# Altium project SM2200-PCB-1.PrjPCB
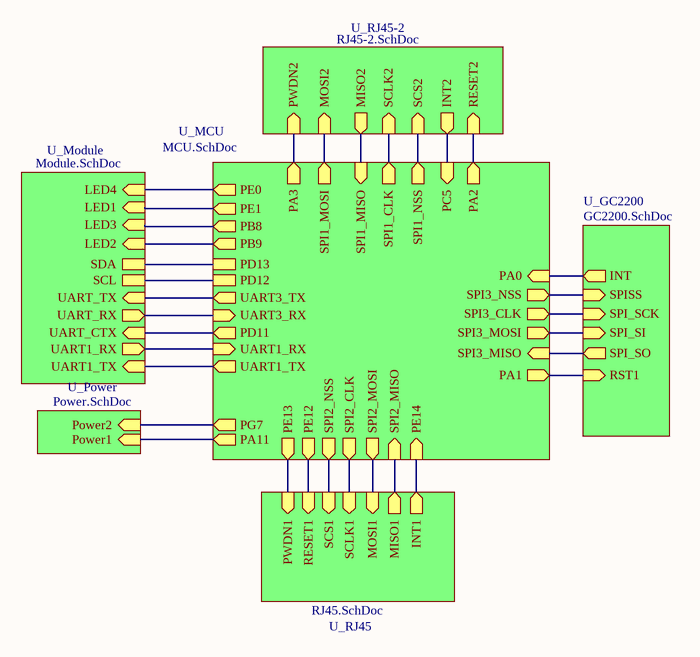
[diagram p0: Top.SchDoc]
7 sheets, 297 parts. Net scope: hierarchical (ports join the sheet entries above them; power ports are global).
Board file: Board.PcbDoc
Sheets:
  Top.SchDoc
    U_GC2200 = GC2200.SchDoc
    U_MCU = MCU.SchDoc
    U_Module = Module.SchDoc
    U_Power = Power.SchDoc
    U_RJ45-2 = RJ45-2.SchDoc
    U_RJ45 = RJ45.SchDoc

## Sheet Top.SchDoc
size A4

### Sub-sheets
U_GC2200 = GC2200.SchDoc: SPISS (in), SPI_SCK (in), SPI_SI (in), SPI_SO (out), RST1 (in), INT (out)
U_MCU = MCU.SchDoc: SPI1_NSS (out), SPI1_CLK (out), SPI1_MISO (in), SPI1_MOSI (out), SPI2_NSS (out), SPI2_CLK (out), SPI2_MISO (in), SPI2_MOSI (out), SPI3_CLK (out), SPI3_MOSI (out), SPI3_NSS (out), SPI3_MISO (in), PA3 (out), PC5 (in), PE13 (out), PE12 (out), PE14 (in), PA1 (out), PA2 (out), PA0 (in), UART1_TX (out), UART1_RX (in), UART3_TX (out), UART3_RX (in), PD11 (out), PD12, PD13, PG7 (out), PA11 (out), PE0 (out), PE1 (out), PB8 (out), PB9 (out)
U_Module = Module.SchDoc: UART_RX (out), UART_TX (in), UART_CTX (in), SCL, SDA, UART1_TX (in), UART1_RX (out), LED2 (in), LED3 (in), LED1 (in), LED4 (in)
U_Power = Power.SchDoc: Power1 (in), Power2 (in)
U_RJ45 = RJ45.SchDoc: INT1 (out), SCS1 (in), SCLK1 (in), MOSI1 (in), MISO1 (out), PWDN1 (in), RESET1 (in)
U_RJ45-2 = RJ45-2.SchDoc: INT2 (out), SCS2 (in), SCLK2 (in), MOSI2 (in), MISO2 (out), PWDN2 (in), RESET2 (in)

### Nets
INT: sheet U_GC2200/INT, sheet U_MCU/PA0
INT1: sheet U_MCU/PE14, sheet U_RJ45/INT1
INT2: sheet U_MCU/PC5, sheet U_RJ45-2/INT2
MISO1: sheet U_MCU/SPI2_MISO, sheet U_RJ45/MISO1
MISO2: sheet U_MCU/SPI1_MISO, sheet U_RJ45-2/MISO2
MOSI1: sheet U_MCU/SPI2_MOSI, sheet U_RJ45/MOSI1
MOSI2: sheet U_MCU/SPI1_MOSI, sheet U_RJ45-2/MOSI2
PWDN1: sheet U_MCU/PE13, sheet U_RJ45/PWDN1
PWDN2: sheet U_MCU/PA3, sheet U_RJ45-2/PWDN2
RESET1: sheet U_MCU/PE12, sheet U_RJ45/RESET1
RESET2: sheet U_MCU/PA2, sheet U_RJ45-2/RESET2
RST1: sheet U_GC2200/RST1, sheet U_MCU/PA1
SCLK1: sheet U_MCU/SPI2_CLK, sheet U_RJ45/SCLK1
SCLK2: sheet U_MCU/SPI1_CLK, sheet U_RJ45-2/SCLK2
SCS1: sheet U_MCU/SPI2_NSS, sheet U_RJ45/SCS1
SCS2: sheet U_MCU/SPI1_NSS, sheet U_RJ45-2/SCS2
SPI3_CLK: sheet U_GC2200/SPI_SCK, sheet U_MCU/SPI3_CLK
SPI3_MISO: sheet U_GC2200/SPI_SO, sheet U_MCU/SPI3_MISO
SPI3_MOSI: sheet U_GC2200/SPI_SI, sheet U_MCU/SPI3_MOSI
SPI3_NSS: sheet U_GC2200/SPISS, sheet U_MCU/SPI3_NSS
NetR41_1: sheet U_MCU/UART3_RX, sheet U_Module/UART_RX
NetR42_2: sheet U_MCU/PD12, sheet U_Module/SCL
NetR45_2: sheet U_MCU/PD13, sheet U_Module/SDA
NetR46_2: sheet U_MCU/PD11, sheet U_Module/UART_CTX
NetR49_1: sheet U_MCU/UART3_TX, sheet U_Module/UART_TX
NetR54_2: sheet U_MCU/PB8, sheet U_Module/LED3
NetR55_2: sheet U_MCU/PB9, sheet U_Module/LED2
NetR56_2: sheet U_MCU/PE0, sheet U_Module/LED4
NetR57_2: sheet U_MCU/PE1, sheet U_Module/LED1
NetR58_1: sheet U_MCU/UART1_TX, sheet U_Module/UART1_TX
NetR59_1: sheet U_MCU/UART1_RX, sheet U_Module/UART1_RX
NetR67_2: sheet U_MCU/PA11, sheet U_Power/Power1
NetR69_2: sheet U_MCU/PG7, sheet U_Power/Power2

## Sheet GC2200.SchDoc
size A4
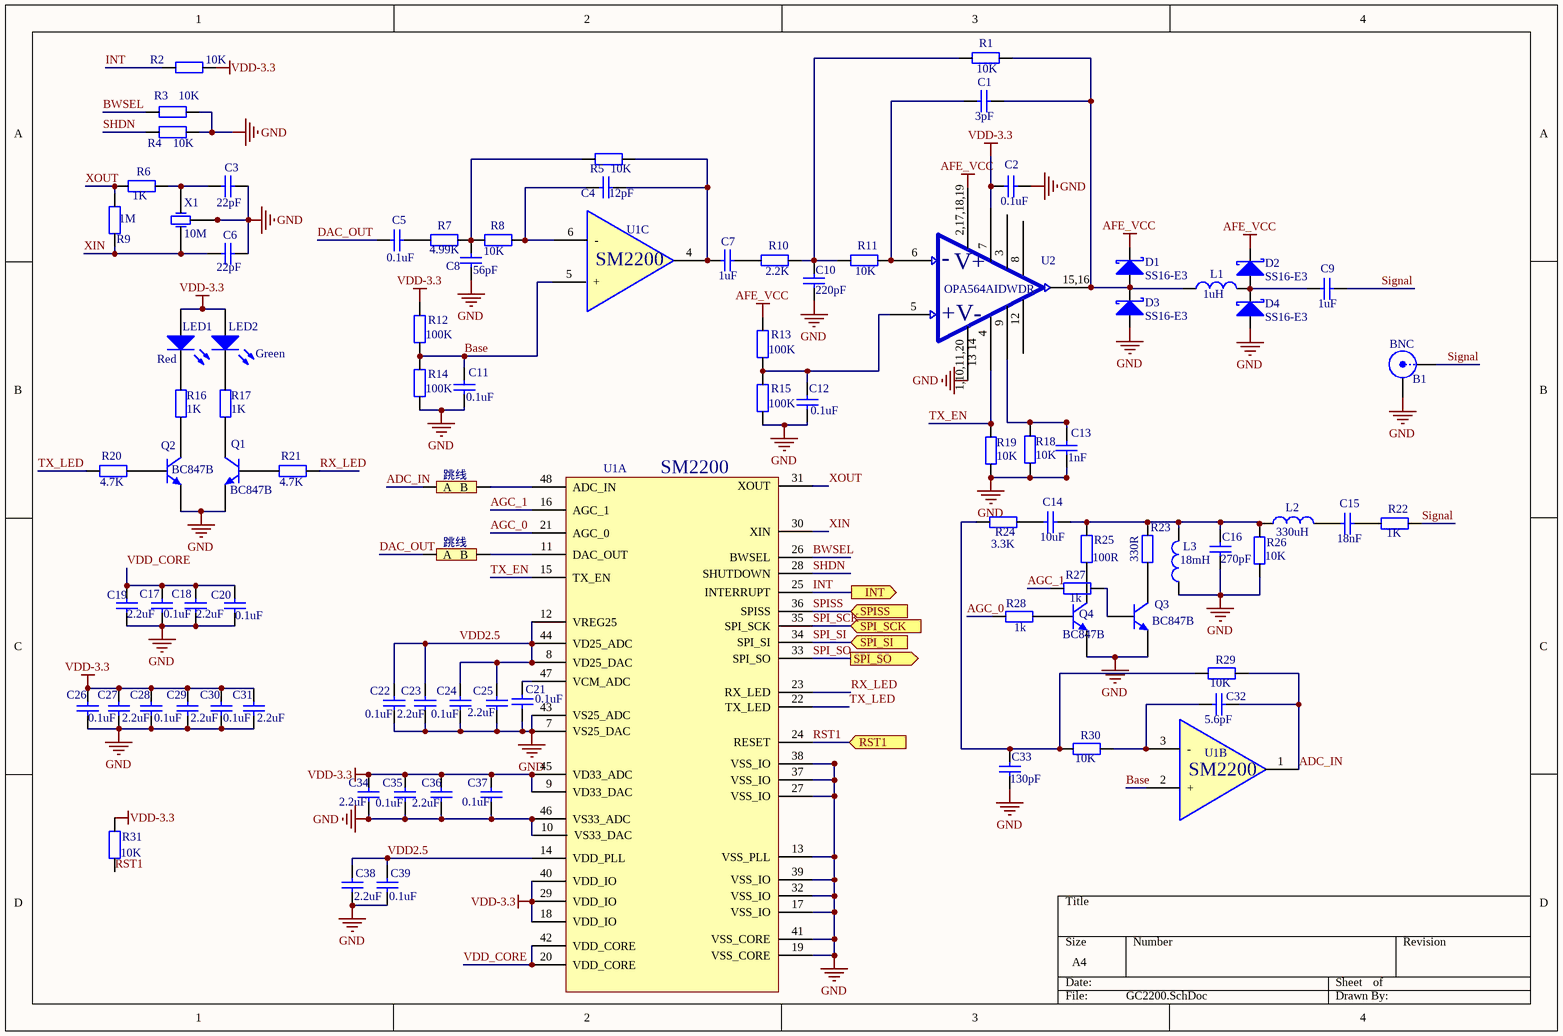
[diagram p1: GC2200.SchDoc]

### Parts
B1  BNC  [BNC]
C1  value 3pF  [0603]  (hidden comment: Capacitor-0603)
C2  value 0.1uF  [0603]  (hidden comment: Capacitor-0603)
C3  value 22pF  [0603]  (hidden comment: Capacitor-0805)
C4  value 12pF  [0603]  (hidden comment: Capacitor-0603)
C5  value 0.1uF  [0603]  (hidden comment: Capacitor-0603)
C6  value 22pF  [0603]  (hidden comment: Capacitor-0805)
C7  value 1uF  [0603]  (hidden comment: Capacitor-0603)
C8  value 56pF  [0603]  (hidden comment: Capacitor-0603)
C9  value 1uF  [0603]  (hidden comment: Capacitor-0603)
C10  value 220pF  [0603]  (hidden comment: Capacitor-0603)
C11  value 0.1uF  [0603]  (hidden comment: Capacitor-0603)
C12  value 0.1uF  [0603]  (hidden comment: Capacitor-0603)
C13  value 1nF  [0603]  (hidden comment: Capacitor-0603)
C14  value 10uF  [0805]  (hidden comment: Capacitor-0603)
C15  value 18nF  [0603]  (hidden comment: Capacitor-0603)
C16  value 270pF  [0603]  (hidden comment: Capacitor-0603)
C17  value 0.1uF  [0603]  (hidden comment: Capacitor-0805)
C18  value 2.2uF  [0603]  (hidden comment: Capacitor-0805)
C19  value 2.2uF  [0603]  (hidden comment: Capacitor-0805)
C20  value 0.1uF  [0603]  (hidden comment: Capacitor-0805)
C21  value 0.1uF  [0603]  (hidden comment: Capacitor-0805)
C22  value 0.1uF  [0603]  (hidden comment: Capacitor-0805)
C23  value 2.2uF  [0603]  (hidden comment: Capacitor-0805)
C24  value 0.1uF  [0603]  (hidden comment: Capacitor-0805)
C25  value 2.2uF  [0603]  (hidden comment: Capacitor-0805)
C26  value 0.1uF  [0603]  (hidden comment: Capacitor-0805)
C27  value 2.2uF  [0603]  (hidden comment: Capacitor-0805)
C28  value 0.1uF  [0603]  (hidden comment: Capacitor-0805)
C29  value 2.2uF  [0603]  (hidden comment: Capacitor-0805)
C30  value 0.1uF  [0603]  (hidden comment: Capacitor-0805)
C31  value 2.2uF  [0603]  (hidden comment: Capacitor-0805)
C32  value 5.6pF  [0603]  (hidden comment: Capacitor-0603)
C33  value 130pF  [0603]  (hidden comment: Capacitor-0603)
C34  value 2.2uF  [0603]  (hidden comment: Capacitor-0805)
C35  value 0.1uF  [0603]  (hidden comment: Capacitor-0805)
C36  value 2.2uF  [0603]  (hidden comment: Capacitor-0805)
C37  value 0.1uF  [0603]  (hidden comment: Capacitor-0805)
C38  value 2.2uF  [0603]  (hidden comment: Capacitor-0805)
C39  value 0.1uF  [0603]  (hidden comment: Capacitor-0805)
D1  Name: SS16-E3  [IN5824]  (hidden comment: SSA34)
D2  Name: SS16-E3  [IN5824]  (hidden comment: SSA34)
D3  Name: SS16-E3  [IN5824]  (hidden comment: SSA34)
D4  Name: SS16-E3  [IN5824]  (hidden comment: SSA34)
L1  value 1uH  [1206]  (hidden comment: Inductor)
L2  value 330uH  [Inductor  12*12]  (hidden comment: Inductor)
L3  value 18mH  [工字电感0608]  (hidden comment: Inductor)
LED1  Color: Red  [外插小灯]  (hidden comment: LED)
LED2  Color: Green  [外插小灯]  (hidden comment: LED)
Q1  BC847  [BC847B]  (value not drawn)
Q2  BC847  [BC847B]  (value not drawn)
Q3  BC847  [BC847B]  (value not drawn)
Q4  BC847  [BC847B]  (value not drawn)
R1  value 10K  [0603]  (hidden comment: Resistor-0603)
R2  value 10K  [0603]  (hidden comment: Resistor-0805)
R3  value 10K  [0603]  (hidden comment: Resistor-0805)
R4  value 10K  [0603]  (hidden comment: Resistor-0805)
R5  value 10K  [0603]  (hidden comment: Resistor-0603)
R6  value 1K  [0603]  (hidden comment: Resistor-0805)
R7  value 4.99K  [0603]  (hidden comment: Resistor-0603)
R8  value 10K  [0603]  (hidden comment: Resistor-0603)
R9  value 1M  [0603]  (hidden comment: Resistor-0805)
R10  value 2.2K  [0603]  (hidden comment: Resistor-0603)
R11  value 10K  [0603]  (hidden comment: Resistor-0603)
R12  value 100K  [0603]  (hidden comment: Resistor-0603)
R13  value 100K  [0603]  (hidden comment: Resistor-0603)
R14  value 100K  [0603]  (hidden comment: Resistor-0603)
R15  value 100K  [0603]  (hidden comment: Resistor-0603)
R16  value 1K  [0603]  (hidden comment: Resistor-0805)
R17  value 1K  [0603]  (hidden comment: Resistor-0805)
R18  value 10K  [0603]  (hidden comment: Resistor-0603)
R19  value 10K  [0603]  (hidden comment: Resistor-0603)
R20  value 4.7K  [0603]  (hidden comment: Resistor-0805)
R21  value 4.7K  [0603]  (hidden comment: Resistor-0805)
R22  value 1K  [0603]  (hidden comment: Resistor-0603)
R23  value 330R  [0603]  (hidden comment: Resistor-0603)
R24  value 3.3K  [0603]  (hidden comment: Resistor-0603)
R25  value 100R  [0603]  (hidden comment: Resistor-0603)
R26  value 10K  [0603]  (hidden comment: Resistor-0603)
R27  value 1k  [0603]  (hidden comment: Resistor-0603)
R28  value 1k  [0603]  (hidden comment: Resistor-0603)
R29  value 10K  [0603]  (hidden comment: Resistor-0603)
R30  value 10K  [0603]  (hidden comment: Resistor-0603)
R31  value 10K  [0603]  (hidden comment: Resistor-0805)
T1  跳线  [跳线 100mil]
T2  跳线  [跳线 100mil]
U1  SM2200  [SM2200]  (parts A,B,C of 3)
U2  OPA564AIDWDR  [OPA564AIDWDR]
X1  value 10M  [3225无源晶振]  (hidden comment: 3225无源晶振)

### Ports
INT (out), RST1 (in), SPI_SCK (in), SPI_SI (in), SPI_SO (out), SPISS (in)

### Nets
AFE_VCC: D1.2(K) D2.2(K) R13.2 U2.2,17,18,19
GND: B1.1(Y) C2.1 C3.2 C6.2 C8.1 C10.2 C11.1 C12.2 C13.1 C16.2 C17.1 C18.1 C19.1 C20.1 C21.1 C22.1 C23.1 C24.1 C25.1 C26.1 C27.1 C28.1 C29.1 C30.1 C31.1 C33.2 C34.1 C35.1 C36.1 C37.1 C38.1 C39.1 D3.1(A) D4.1(A) L3.1 Q1.1(E) Q2.1(E) Q3.1(E) Q4.1(E) R3.2 R4.2 R14.1 R15.1 R18.1 R19.1 R26.1 U1.7(VS25_DAC) U1.10(VS33_DAC) U1.13(VSS_PLL) U1.17(VSS_IO) U1.19(VSS_CORE) U1.27(VSS_IO) U1.32(VSS_IO) U1.37(VSS_IO) U1.38(VSS_IO) U1.39(VSS_IO) U1.41(VSS_CORE) U1.43(VS25_ADC) U1.46(VS33_ADC) U2.1,10,11,20 X1.2(GND) X1.4(GND)
VDD-3.3: C2.2 C26.2 C27.2 C28.2 C29.2 C30.2 C31.2 C34.2 C35.2 C36.2 C37.2 LED1.1(A) LED2.1(A) R2.2 R12.2 R31.1 U1.9(VD33_DAC) U1.18(VDD_IO) U1.29(VDD_IO) U1.40(VDD_IO) U1.45(VD33_ADC) U2.7
ADC_IN: C32.2 R29.1 T1.1(A) U1.1
AGC_0: R28.2 U1.21(AGC_0)
AGC_1: R27.2 U1.16(AGC_1)
Base: C11.2 R12.1 R14.2 U1.2(+) U1.5(+)
BWSEL: R3.1 U1.26(BWSEL)
DAC_OUT: C5.2 T2.1(A)
INT: R2.1 U1.25(INTERRUPT) ; port INT
RST1: R31.2 U1.24(RESET) ; port RST1
RX_LED: R21.1 U1.23(RX_LED)
SHDN: R4.1 U1.28(SHUTDOWN)
Signal: B1.2(X) C9.1 R22.2
SPI_SCK: U1.35(SPI_SCK) ; port SPI_SCK  [project net SPI3_CLK]
SPI_SI: U1.34(SPI_SI) ; port SPI_SI  [project net SPI3_MOSI]
SPI_SO: U1.33(SPI_SO) ; port SPI_SO  [project net SPI3_MISO]
SPISS: U1.36(SPISS) ; port SPISS  [project net SPI3_NSS]
TX_EN: R19.2 U1.15(TX_EN) U2.4
TX_LED: R20.2 U1.22(TX_LED)
VDD2.5: C22.2 C23.2 C24.2 C25.2 C38.2 C39.2 U1.8(VD25_DAC) U1.12(VREG25) U1.14(VDD_PLL) U1.44(VD25_ADC)
VDD_CORE: C17.2 C18.2 C19.2 C20.2 U1.20(VDD_CORE) U1.42(VDD_CORE)
XIN: C6.1 R9.1 U1.30(XIN) X1.1(OSC1)
XOUT: R6.1 R9.2 U1.31(XOUT)
NetC1_1: C1.1 D1.1(A) D3.2(K) L1.1 R1.2 U2.15,16
NetC1_2: C1.2 R11.2 U2.6
NetC3_1: C3.1 R6.2 X1.3(OSC2)
NetC4_1: C4.1 C7.2 R5.2 U1.4
NetC4_2: C4.2 R8.2 U1.6(-)
NetC5_1: C5.1 R7.1
NetC7_1: C7.1 R10.1
NetC8_2: C8.2 R5.1 R7.2 R8.1
NetC9_2: C9.2 D2.1(A) D4.2(K) L1.2
NetC10_1: C10.1 R1.1 R10.2 R11.1
NetC12_1: C12.1 R13.1 R15.2 U2.5
NetC13_2: C13.2 R18.2 U2.9
NetC14_1: C14.1 C16.1 L2.1 L3.2 R23.2 R25.2 R26.2
NetC14_2: C14.2 R24.1
NetC15_1: C15.1 R22.1
NetC15_2: C15.2 L2.2
NetC21_2: C21.2 U1.47(VCM_ADC)
NetC32_1: C32.1 R30.1 U1.3(-)
NetC33_1: C33.1 R24.2 R29.2 R30.2
NetLED1_2: LED1.2 R16.2
NetLED2_2: LED2.2 R17.2
NetQ1_2: Q1.2(B) R21.2
NetQ1_3: Q1.3(C) R17.1
NetQ2_2: Q2.2(B) R20.1
NetQ2_3: Q2.3(C) R16.1
NetQ3_2: Q3.2(B) R27.1
NetQ3_3: Q3.3(C) R23.1
NetQ4_2: Q4.2(B) R28.1
NetQ4_3: Q4.3(C) R25.1
NetT1_2: T1.2(B) U1.48(ADC_IN)
NetT2_2: T2.2(B) U1.11(DAC_OUT)

Not connected (* = marked no-connect by the designer): U2 3 8 12

### Notes on the sheet
- (in symbol OPA564AIDWDR) -; V+; +; V-; 14; 13

### Library data of the parts
C3 C6 C17-C31 C34-C39 = Capacito
R2-R4 R6 R9 R16 R17 R20 R21 R31 = Resisto
U2 = OPA564AIDWDR: pin to pad: 1,10,11,20>1+10+11+20+13+14; Name: OPA564AIDWDR
B1 = BNC: Name: BNC
LED1 LED2 = LED: Value: LED
Q1-Q4 = BC847: Name: BC847B
T1 T2 = 跳线: Value: 跳线

## Sheet MCU.SchDoc
size A4
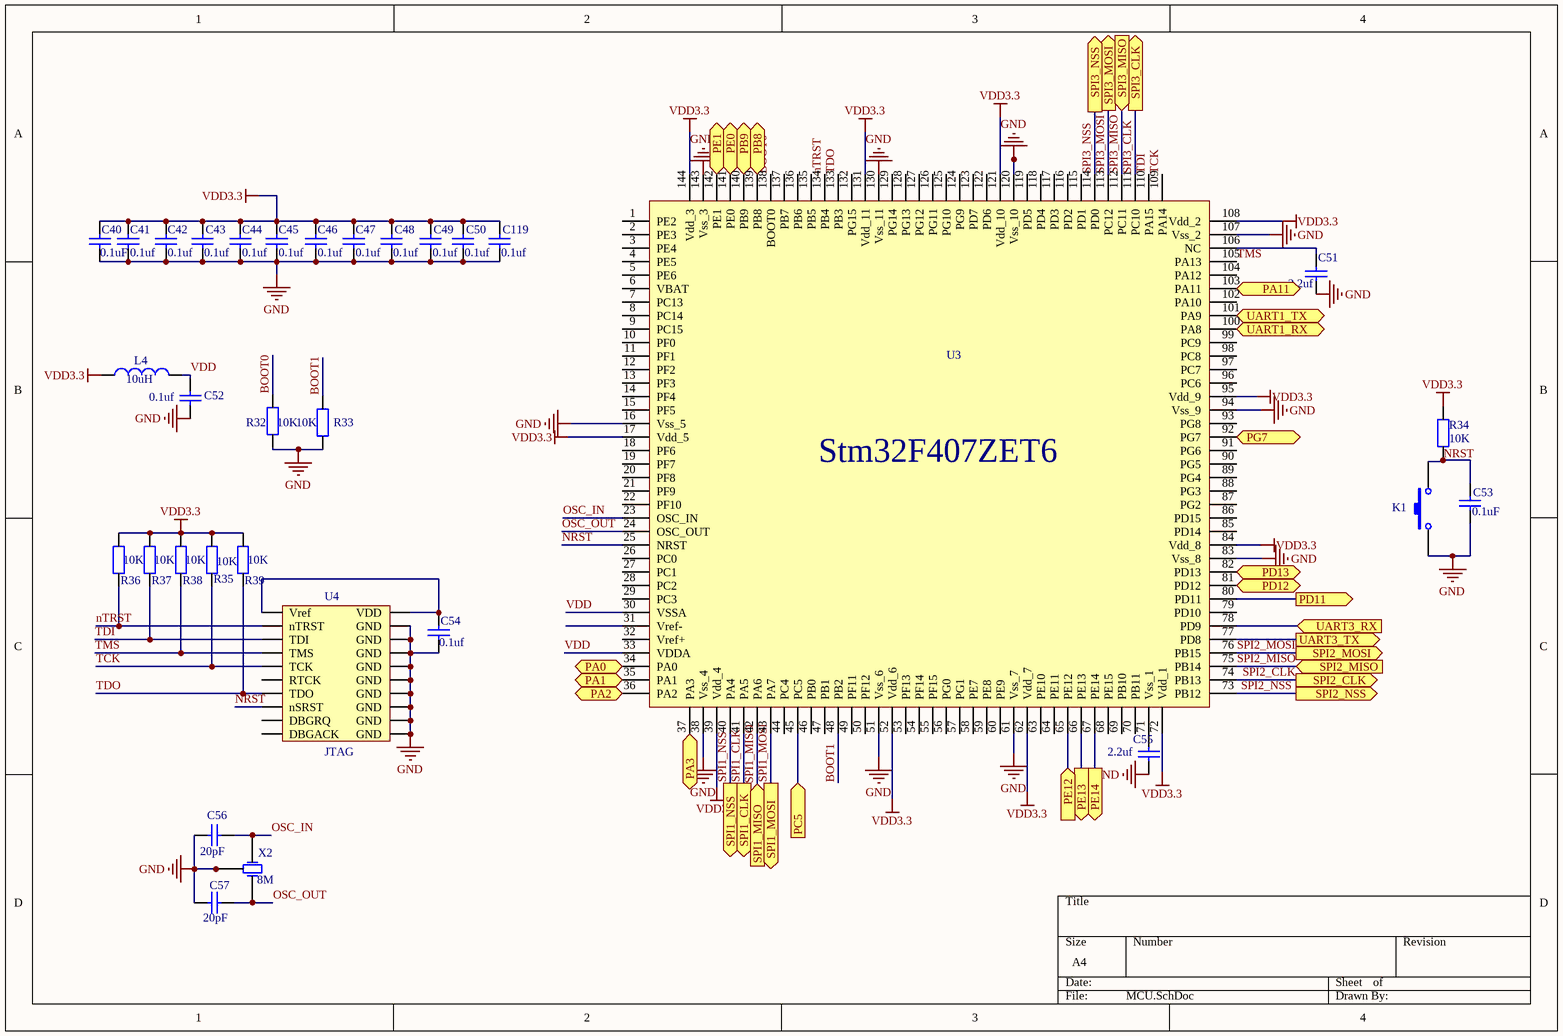
[diagram p2: MCU.SchDoc]

### Parts
C40  value 0.1uF  [0603]  (hidden comment: Capacitor-0805)
C41  value 0.1uf  [0603]  (hidden comment: Capacitor-0805)
C42  value 0.1uf  [0603]  (hidden comment: Capacitor-0805)
C43  value 0.1uf  [0603]  (hidden comment: Capacitor-0805)
C44  value 0.1uf  [0603]  (hidden comment: Capacitor-0805)
C45  value 0.1uf  [0603]  (hidden comment: Capacitor-0805)
C46  value 0.1uf  [0603]  (hidden comment: Capacitor-0805)
C47  value 0.1uf  [0603]  (hidden comment: Capacitor-0805)
C48  value 0.1uf  [0603]  (hidden comment: Capacitor-0805)
C49  value 0.1uf  [0603]  (hidden comment: Capacitor-0805)
C50  value 0.1uf  [0603]  (hidden comment: Capacitor-0805)
C51  value 2.2uf  [0603]  (hidden comment: Capacitor-0603)
C52  value 0.1uf  [0603]  (hidden comment: Capacitor-0805)
C53  value 0.1uF  [0603]  (hidden comment: Capacitor-0805)
C54  value 0.1uf  [0603]  (hidden comment: Capacitor-0805)
C55  value 2.2uf  [0603]  (hidden comment: Capacitor-0603)
C56  value 20pF  [0603]  (hidden comment: Capacitor-0805)
C57  value 20pF  [0603]  (hidden comment: Capacitor-0805)
C119  value 0.1uf  [0603]  (hidden comment: Capacitor-0805)
K1  按键  [贴片按键]  (value not drawn)
L4  value 10uH  [0805]  (hidden comment: Inductor)
R32  value 10K  [0603]  (hidden comment: Resistor-0805)
R33  value 10K  [0603]  (hidden comment: Resistor-0805)
R34  value 10K  [0603]  (hidden comment: Resistor-0805)
R35  value 10K  [0603]  (hidden comment: Resistor-0805)
R36  value 10K  [0603]  (hidden comment: Resistor-0805)
R37  value 10K  [0603]  (hidden comment: Resistor-0805)
R38  value 10K  [0603]  (hidden comment: Resistor-0805)
R39  value 10K  [0603]  (hidden comment: Resistor-0805)
U3  STM32F407ZET6  [Stm32f407ZET6 - duplicate]  (value not drawn)
U4  JTAG  [JTAG-20]
X2  value 8M  [3225无源晶振]  (hidden comment: 3225无源晶振)

### Ports
PA0 (in), PA1 (out), PA2 (out), PA3 (out), PA11 (out), PB8 (out), PB9 (out), PC5 (in), PD11 (out), PD12, PD13, PE0 (out), PE1 (out), PE12 (in), PE13 (out), PE14 (out), PG7 (out), SPI1_CLK (out), SPI1_MISO (in), SPI1_MOSI (out), SPI1_NSS (out), SPI2_CLK (out), SPI2_MISO (in), SPI2_MOSI (out), SPI2_NSS (out), SPI3_CLK (out), SPI3_MISO (in), SPI3_MOSI (out), SPI3_NSS (out), UART1_RX (in), UART1_TX (out), UART3_RX (in), UART3_TX (out)

### Nets
GND: C40.1 C41.1 C42.1 C43.1 C44.1 C45.1 C46.1 C47.1 C48.1 C49.1 C50.1 C51.1 C52.1 C53.1 C54.1 C55.1 C56.1 C57.1 C119.1 K1.1 R32.1 R33.1 U3.16(Vss_5) U3.38(Vss_4) U3.51(Vss_6) U3.61(Vss_7) U3.83(Vss_8) U3.94(Vss_9) U3.107(Vss_2) U3.120(Vss_10) U3.130(Vss_11) U3.143(Vss_3) U4.4(GND) U4.6(GND) U4.8(GND) U4.10(GND) U4.12(GND) U4.14(GND) U4.16(GND) U4.18(GND) U4.20(GND) X2.2(GND) X2.4(GND)
VDD3.3: C40.2 C41.2 C42.2 C43.2 C44.2 C45.2 C46.2 C47.2 C48.2 C49.2 C50.2 C119.2 L4.1 R34.2 R35.2 R36.2 R37.2 R38.2 R39.2 U3.17(Vdd_5) U3.39(Vdd_4) U3.52(Vdd_6) U3.62(Vdd_7) U3.72(Vdd_1) U3.84(Vdd_8) U3.95(Vdd_9) U3.108(Vdd_2) U3.121(Vdd_10) U3.131(Vdd_11) U3.144(Vdd_3)
BOOT0: R32.2 U3.138(BOOT0)
BOOT1: R33.2 U3.48(PB2)
INT: U3.34(PA0) ; port PA0
INT1: U3.67(PE14) ; port PE14
INT2: U3.45(PC5) ; port PC5
NRST: C53.2 K1.2 R34.1 U3.25(NRST) U4.15(nSRST)
nTRST: R36.1 U3.134(PB4) U4.3(nTRST)
OSC_IN: C56.2 U3.23(OSC_IN) X2.1(OSC1)
OSC_OUT: C57.2 U3.24(OSC_OUT) X2.3(OSC2)
PWDN1: U3.66(PE13) ; port PE13
PWDN2: U3.37(PA3) ; port PA3
RESET1: U3.65(PE12) ; port PE12
RESET2: U3.36(PA2) ; port PA2
RST1: U3.35(PA1) ; port PA1
SPI1_CLK: U3.41(PA5) ; port SPI1_CLK  [project net SCLK2]
SPI1_MISO: U3.42(PA6) ; port SPI1_MISO  [project net MISO2]
SPI1_MOSI: U3.43(PA7) ; port SPI1_MOSI  [project net MOSI2]
SPI1_NSS: U3.40(PA4) ; port SPI1_NSS  [project net SCS2]
SPI2_CLK: U3.74(PB13) ; port SPI2_CLK  [project net SCLK1]
SPI2_MISO: U3.75(PB14) ; port SPI2_MISO  [project net MISO1]
SPI2_MOSI: U3.76(PB15) ; port SPI2_MOSI  [project net MOSI1]
SPI2_NSS: U3.73(PB12) ; port SPI2_NSS  [project net SCS1]
SPI3_CLK: U3.111(PC10) ; port SPI3_CLK
SPI3_MISO: U3.112(PC11) ; port SPI3_MISO
SPI3_MOSI: U3.113(PC12) ; port SPI3_MOSI
SPI3_NSS: U3.114(PD0) ; port SPI3_NSS
TCK: R35.1 U3.109(PA14) U4.9(TCK)
TDI: R37.1 U3.110(PA15) U4.5(TDI)
TDO: R39.1 U3.133(PB3) U4.13(TDO)
TMS: R38.1 U3.105(PA13) U4.7(TMS)
VDD: C52.2 L4.2 U3.30(VSSA) U3.33(VDDA)
NetC51_2: C51.2 U3.106(NC)
NetC54_2: C54.2 U4.1(Vref) U4.2(VDD)
NetC55_2: C55.2 U3.71(Vss_1)
NetR41_1: U3.78(PD9) ; port UART3_RX
NetR42_2: U3.81(PD12) ; port PD12
NetR45_2: U3.82(PD13) ; port PD13
NetR46_2: U3.80(PD11) ; port PD11
NetR49_1: U3.77(PD8) ; port UART3_TX
NetR54_2: U3.139(PB8) ; port PB8
NetR55_2: U3.140(PB9) ; port PB9
NetR56_2: U3.141(PE0) ; port PE0
NetR57_2: U3.142(PE1) ; port PE1
NetR58_1: U3.101(PA9) ; port UART1_TX
NetR59_1: U3.100(PA8) ; port UART1_RX
NetR67_2: U3.103(PA11) ; port PA11
NetR69_2: U3.92(PG7) ; port PG7

Not connected (* = marked no-connect by the designer): U3 1(PE2) 2(PE3) 3(PE4) 4(PE5) 5(PE6) 6(VBAT) 7(PC13) 8(PC14) 9(PC15) 10(PF0) 11(PF1) 12(PF2) 13(PF3) 14(PF4) 15(PF5) 18(PF6) 19(PF7) 20(PF8) 21(PF9) 22(PF10) 26(PC0) 27(PC1) 28(PC2) 29(PC3) 31(Vref-) 32(Vref+) 44(PC4) 46(PB0) 47(PB1) 49(PF11) 50(PF12) 53(PF13) 54(PF14) 55(PF15) 56(PG0) 57(PG1) 58(PE7) 59(PE8) 60(PE9) 63(PE10) 64(PE11) 68(PE15) 69(PB10) 70(PB11) 79(PD10) 85(PD14) 86(PD15) 87(PG2) 88(PG3) 89(PG4) 90(PG5) 91(PG6) 93(PG8) 96(PC6) 97(PC7) 98(PC8) 99(PC9) 102(PA10) 104(PA12) 115(PD1) 116(PD2) 117(PD3) 118(PD4) 119(PD5) 122(PD6) 123(PD7) 124(PG9) 125(PG10) 126(PG11) 127(PG12) 128(PG13) 129(PG14) 132(PG15) 135(PB5) 136(PB6) 137(PB7); U4 11(RTCK) 17(DBGRQ) 19(DBGACK)

### Notes on the sheet
- (in symbol STM32F407Z) Stm32F407ZET6

### Library data of the parts
C40-C50 C52 C54 C119 = Capacitor
C53 C56 C57 = Capacitor-0
L4 = Ind
R32 R33 = Resistor
R34-R39 = Resistor-0
U3 = STM32F407Z: Value: STM32F407ZET6
U4 = J: Value: JTAG

## Sheet Module.SchDoc
size A4
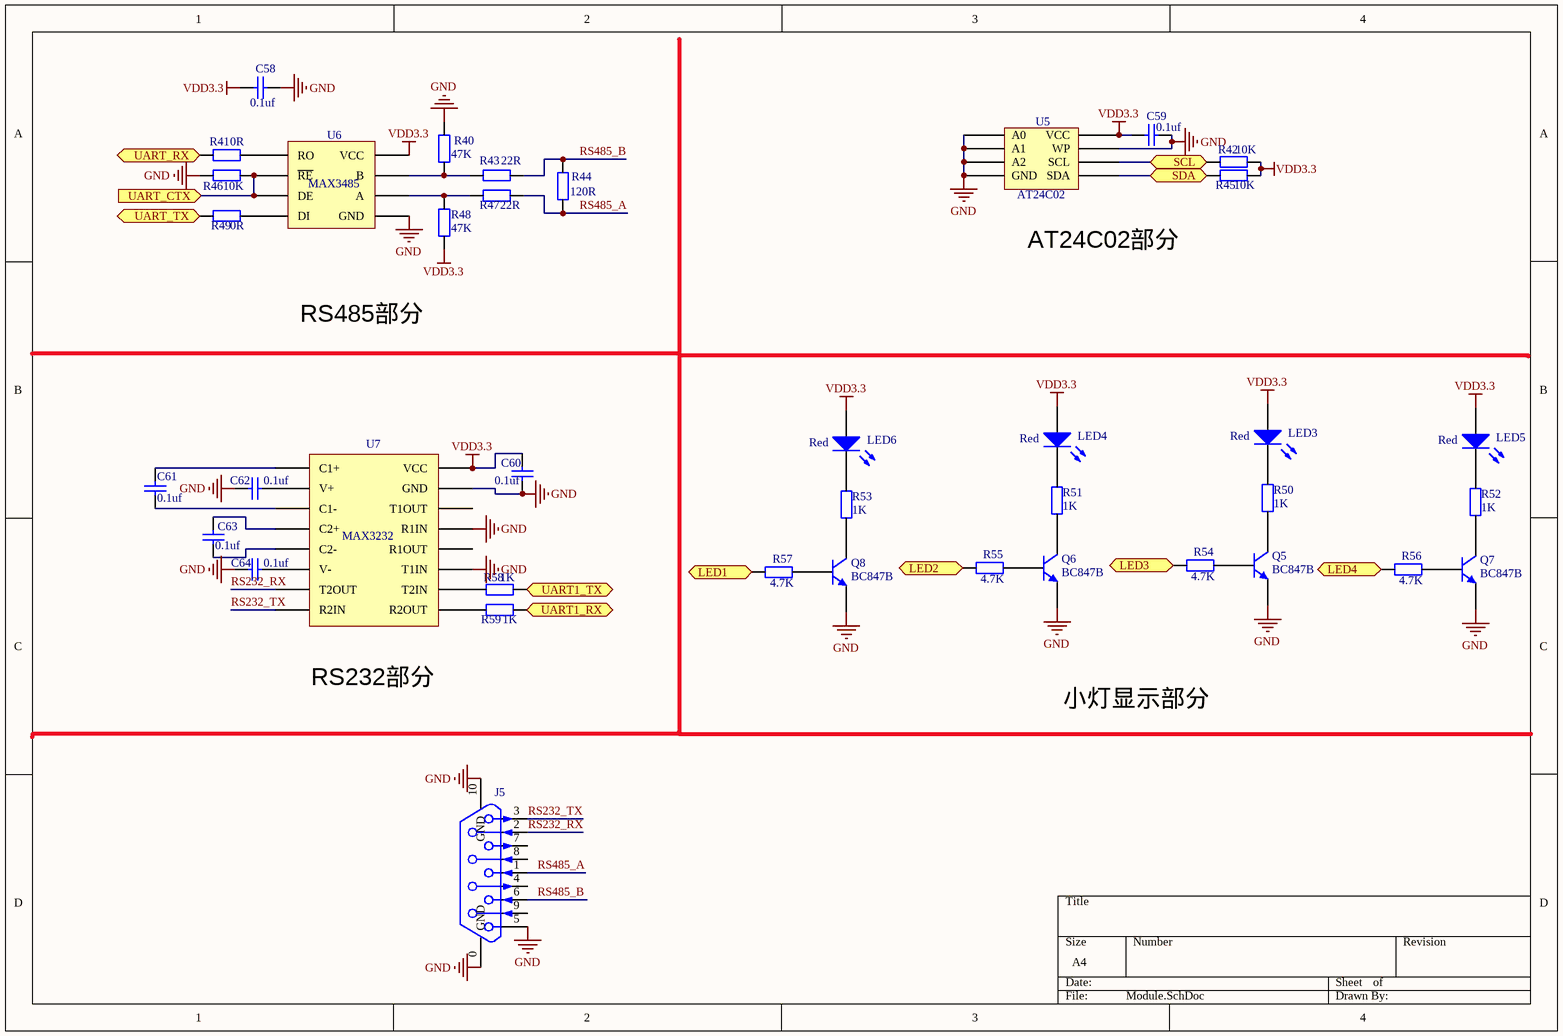
[diagram p3: Module.SchDoc]

### Parts
C58  value 0.1uf  [0603]  (hidden comment: Capacitor-0603)
C59  value 0.1uf  [0603]  (hidden comment: Capacitor-0603)
C60  value 0.1uf  [0603]  (hidden comment: Capacitor-0603)
C61  value 0.1uf  [0603]  (hidden comment: Capacitor-0603)
C62  value 0.1uf  [0603]  (hidden comment: Capacitor-0603)
C63  value 0.1uf  [0603]  (hidden comment: Capacitor-0603)
C64  value 0.1uf  [0603]  (hidden comment: Capacitor-0603)
J5  DB9  [DB9]  (value not drawn)
LED3  Color: Red  [外插小灯]  (hidden comment: LED)
LED4  Color: Red  [外插小灯]  (hidden comment: LED)
LED5  Color: Red  [外插小灯]  (hidden comment: LED)
LED6  Color: Red  [外插小灯]  (hidden comment: LED)
Q5  BC847  [BC847B]  (value not drawn)
Q6  BC847  [BC847B]  (value not drawn)
Q7  BC847  [BC847B]  (value not drawn)
Q8  BC847  [BC847B]  (value not drawn)
R40  value 47K  [0603]  (hidden comment: Resistor-0603)
R41  value 0R  [0603]  (hidden comment: Resistor-0603)
R42  value 10K  [0603]  (hidden comment: Resistor-0603)
R43  value 22R  [0603]  (hidden comment: Resistor-0603)
R44  value 120R  [0603]  (hidden comment: Resistor-0603)
R45  value 10K  [0603]  (hidden comment: Resistor-0603)
R46  value 10K  [0603]  (hidden comment: Resistor-0603)
R47  value 22R  [0603]  (hidden comment: Resistor-0603)
R48  value 47K  [0603]  (hidden comment: Resistor-0603)
R49  value 0R  [0603]  (hidden comment: Resistor-0603)
R50  value 1K  [0603]  (hidden comment: Resistor-0603)
R51  value 1K  [0603]  (hidden comment: Resistor-0603)
R52  value 1K  [0603]  (hidden comment: Resistor-0603)
R53  value 1K  [0603]  (hidden comment: Resistor-0603)
R54  value 4.7K  [0603]  (hidden comment: Resistor-0603)
R55  value 4.7K  [0603]  (hidden comment: Resistor-0603)
R56  value 4.7K  [0603]  (hidden comment: Resistor-0603)
R57  value 4.7K  [0603]  (hidden comment: Resistor-0603)
R58  value 1K  [0603]  (hidden comment: Resistor-0603)
R59  value 1K  [0603]  (hidden comment: Resistor-0603)
U5  AT24C02  [AT24C02]
U6  MAX3485  [MAX3485]
U7  MAX3232  [MAX3232]

### Ports
LED1 (in), LED2 (in), LED3 (in), LED4 (in), SCL, SDA, UART1_RX (out), UART1_TX (in), UART_CTX (in), UART_RX (out), UART_TX (in)

### Nets
GND: C58.2 C59.1 C60.1 C62.2 C64.2 J5.0(GND) J5.5 J5.10(GND) Q5.1(E) Q6.1(E) Q7.1(E) Q8.1(E) R40.2 R46.1 U5.1(A0) U5.2(A1) U5.3(A2) U5.4(GND) U5.7(WP) U6.5(GND) U7.11(T1IN) U7.13(R1IN) U7.15(GND)
VDD3.3: C58.1 C59.2 C60.2 LED3.1(A) LED4.1(A) LED5.1(A) LED6.1(A) R42.1 R45.1 R48.1 U5.8(VCC) U6.8(VCC) U7.16(VCC)
RS232_RX: J5.2 U7.7(T2OUT)
RS232_TX: J5.3 U7.8(R2IN)
RS485_A: J5.1 R44.2 R47.1
RS485_B: J5.6 R43.1 R44.1
NetC61_1: C61.1 U7.3(C1-)
NetC61_2: C61.2 U7.1(C1+)
NetC62_1: C62.1 U7.2(V+)
NetC63_1: C63.1 U7.5(C2-)
NetC63_2: C63.2 U7.4(C2+)
NetC64_1: C64.1 U7.6(V-)
NetLED3_2: LED3.2 R50.2
NetLED4_2: LED4.2 R51.2
NetLED5_2: LED5.2 R52.2
NetLED6_2: LED6.2 R53.2
NetQ5_2: Q5.2(B) R54.1
NetQ5_3: Q5.3(C) R50.1
NetQ6_2: Q6.2(B) R55.1
NetQ6_3: Q6.3(C) R51.1
NetQ7_2: Q7.2(B) R56.1
NetQ7_3: Q7.3(C) R52.1
NetQ8_2: Q8.2(B) R57.1
NetQ8_3: Q8.3(C) R53.1
NetR40_1: R40.1 R43.2 U6.7(B)
NetR41_1: R41.1 ; port UART_RX
NetR41_2: R41.2 U6.1(RO)
NetR42_2: R42.2 U5.6(SCL) ; port SCL
NetR45_2: R45.2 U5.5(SDA) ; port SDA
NetR46_2: R46.2 U6.2(~{RE}) U6.3(DE) ; port UART_CTX
NetR47_2: R47.2 R48.2 U6.6(A)
NetR49_1: R49.1 ; port UART_TX
NetR49_2: R49.2 U6.4(DI)
NetR54_2: R54.2 ; port LED3
NetR55_2: R55.2 ; port LED2
NetR56_2: R56.2 ; port LED4
NetR57_2: R57.2 ; port LED1
NetR58_1: R58.1 ; port UART1_TX
NetR58_2: R58.2 U7.10(T2IN)
NetR59_1: R59.1 ; port UART1_RX
NetR59_2: R59.2 U7.9(R2OUT)

Not connected (* = marked no-connect by the designer): J5 4 7 8 9; U7 12(R1OUT) 14(T1OUT)

### Notes on the sheet
- (near U5) AT24C02部分
- RS485部分
- RS232部分
- 小灯显示部分

### Library data of the parts
LED3-LED6 = LED: Value: LED
Q5-Q8 = BC847: Name: BC847B
U5 = AT24C02: Name: AT24C02
U6 = MAX3485: Name: MAX3485
U7 = MAX3232: Name: MAX3232

## Sheet Power.SchDoc
size A4
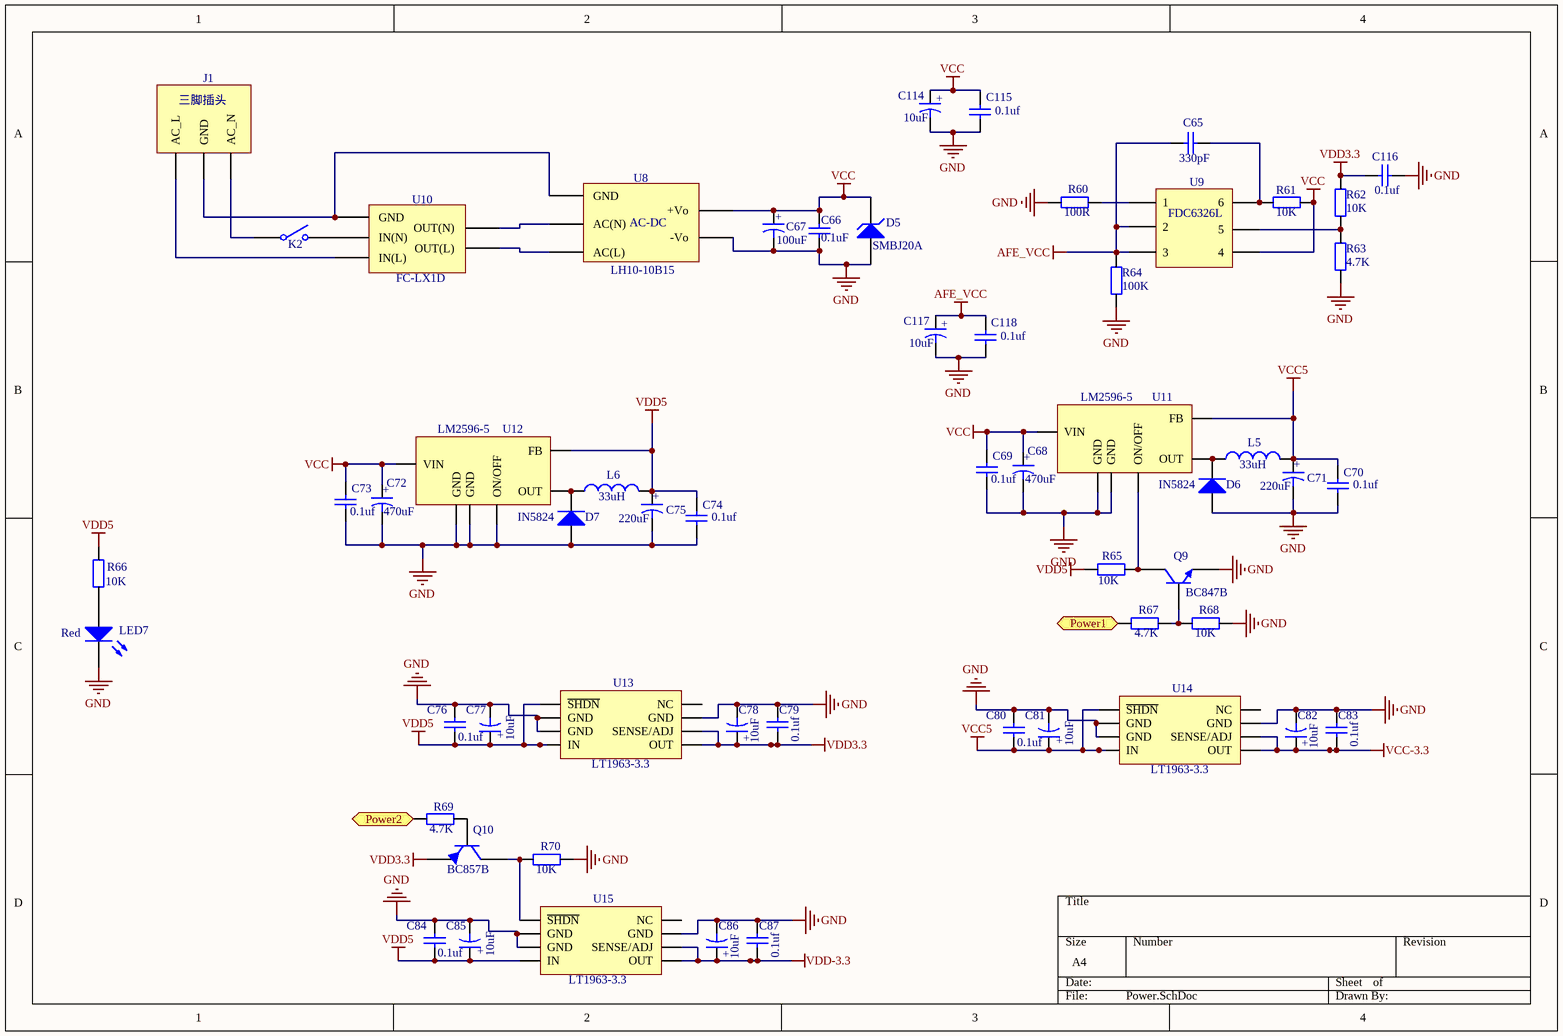
[diagram p4: Power.SchDoc]

### Parts
C65  value 330pF  [0805]  (hidden comment: Capacitor-0805)
C66  value 0.1uF  [0805]  (hidden comment: Capacitor-0805)
C67  value 100uF  [贴片铝电容-8*10.3]  (hidden comment: 电解电容)
C68  value 470uF  [贴片铝电容-10*10]  (hidden comment: 电解电容)
C69  value 0.1uf  [0805]  (hidden comment: Capacitor-0805)
C70  value 0.1uf  [0805]  (hidden comment: Capacitor-0805)
C71  value 220uF  [贴片铝电容-8*10.3]  (hidden comment: 电解电容)
C72  value 470uF  [贴片铝电容-10*10]  (hidden comment: 电解电容)
C73  value 0.1uf  [0805]  (hidden comment: Capacitor-0805)
C74  value 0.1uf  [0805]  (hidden comment: Capacitor-0805)
C75  value 220uF  [贴片铝电容-8*10.3]  (hidden comment: 电解电容)
C76  value 0.1uf  [0805]  (hidden comment: Capacitor-0805)
C77  value 10uF  [钽电容1206（A3216）]  (hidden comment: 电解电容)
C78  value 10uF  [钽电容1206（A3216）]  (hidden comment: 电解电容)
C79  value 0.1uf  [0805]  (hidden comment: Capacitor-0805)
C80  value 0.1uf  [0805]  (hidden comment: Capacitor-0805)
C81  value 10uF  [钽电容1206（A3216）]  (hidden comment: 电解电容)
C82  value 10uF  [钽电容1206（A3216）]  (hidden comment: 电解电容)
C83  value 0.1uf  [0805]  (hidden comment: Capacitor-0805)
C84  value 0.1uf  [0805]  (hidden comment: Capacitor-0805)
C85  value 10uF  [钽电容1206（A3216）]  (hidden comment: 电解电容)
C86  value 10uF  [钽电容1206（A3216）]  (hidden comment: 电解电容)
C87  value 0.1uf  [0805]  (hidden comment: Capacitor-0805)
C114  value 10uF  [3528]  (hidden comment: 电解电容)
C115  value 0.1uf  [0805]  (hidden comment: Capacitor-0805)
C116  value 0.1uf  [0603]  (hidden comment: Capacitor-0805)
C117  value 10uF  [3528]  (hidden comment: 电解电容)
C118  value 0.1uf  [0805]  (hidden comment: Capacitor-0805)
D5  SMBJ20A  [SMBJ20A]
D6  IN5824  [IN5824]
D7  IN5824  [IN5824]
J1  三脚插头  [三芯蛙座]
K2  开关  [T型接头]  (value not drawn)
L5  value 33uH  [SLF6025   电感]  (hidden comment: Inductor)
L6  value 33uH  [SLF6025   电感]  (hidden comment: Inductor)
LED7  Color: Red  [外插小灯]  (hidden comment: LED)
Q9  BC847  [BC847B]  (value not drawn)
Q10  Name: BC857B  [BC847B]  (hidden comment: BC587B)
R60  value 100R  [0603]  (hidden comment: Resistor-0603)
R61  value 10K  [0603]  (hidden comment: Resistor-0603)
R62  value 10K  [0603]  (hidden comment: Resistor-0603)
R63  value 4.7K  [0603]  (hidden comment: Resistor-0603)
R64  value 100K  [0603]  (hidden comment: Resistor-0603)
R65  value 10K  [0603]  (hidden comment: Resistor-0603)
R66  value 10K  [0603]  (hidden comment: Resistor-0603)
R67  value 4.7K  [0603]  (hidden comment: Resistor-0603)
R68  value 10K  [0603]  (hidden comment: Resistor-0603)
R69  value 4.7K  [0603]  (hidden comment: Resistor-0603)
R70  value 10K  [0603]  (hidden comment: Resistor-0603)
U8  Describe: AC-DC  [LH10-10B15]  (hidden comment: LH10-10B15)
U9  FDC6326L  [FDC6326L]
U10  FC-LX1D  [FC-LX1D]
U11  LM2596  [LM2596]  (value not drawn)
U12  LM2596  [LM2596]  (value not drawn)
U13  LT1963  [LT1963]  (value not drawn)
U14  LT1963  [LT1963]  (value not drawn)
U15  LT1963  [LT1963]  (value not drawn)

### Ports
Power1 (in), Power2 (in)

### Nets
AFE_VCC: C65.2 C117.2 C118.2 R64.2 U9.2 U9.3
GND: C66.1 C67.1 C68.1 C69.1 C70.1 C71.1 C72.1 C73.1 C74.1 C75.1 C76.2 C77.1 C78.1 C79.2 C80.2 C81.1 C82.1 C83.2 C84.2 C85.1 C86.1 C87.2 C114.1 C115.1 C116.1 C117.1 C118.1 D5.1(A) D6.1(A) D7.1(A) LED7.2 Q9.1(E) R60.1 R63.1 R64.1 R68.1 R70.1 U8.4(-Vo) U11.3(GND) U11.6(GND) U12.3(GND) U12.5(ON/OFF) U12.6(GND) U13.3(GND) U13.6(GND) U13.7(GND) U14.3(GND) U14.6(GND) U14.7(GND) U15.3(GND) U15.6(GND) U15.7(GND)
VCC: C66.2 C67.2 C68.2 C69.2 C72.2 C73.2 C114.2 C115.2 D5.2(K) R61.1 U8.8(+Vo) U9.4 U11.1(VIN) U12.1(VIN)
VCC5: C70.2 C71.2 C80.1 C81.2 L5.2 U11.4(FB) U14.5(~{SHDN}) U14.8(IN)
VCC-3.3: C82.2 C83.1 U14.1(OUT) U14.2(SENSE/ADJ)
VDD3.3: C78.2 C79.1 C116.2 Q10.1(E) R62.2 U13.1(OUT) U13.2(SENSE/ADJ)
VDD5: C74.2 C75.2 C76.1 C77.2 C84.1 C85.2 L6.2 R65.1 R66.2 U12.4(FB) U13.5(~{SHDN}) U13.8(IN) U15.8(IN)
VDD-3.3: C86.2 C87.1 U15.1(OUT) U15.2(SENSE/ADJ)
NetC65_1: C65.1 R61.2 U9.6
NetD6_2: D6.2(K) L5.1 U11.2(OUT)
NetD7_2: D7.2(K) L6.1 U12.2(OUT)
NetJ1_1: J1.1(AC_L) U10.3(IN(L))
NetJ1_2: J1.2(GND) U8.1(GND) U10.1(GND)
NetJ1_3: J1.3(AC_N) K2.1(COMMON)
NetK2_2: K2.2(NO) U10.2(IN(N))
NetLED7_1: LED7.1(A) R66.1
NetQ9_2: Q9.2(B) R67.1 R68.2
NetQ9_3: Q9.3(C) R65.2 U11.5(ON/OFF)
NetQ10_2: Q10.2(B) R69.1
NetQ10_3: Q10.3(C) R70.2 U15.5(~{SHDN})
NetR60_2: R60.2 U9.1
NetR62_1: R62.1 R63.2 U9.5
NetR67_2: R67.2 ; port Power1
NetR69_2: R69.2 ; port Power2
NetU8_2: U8.2(AC(N)) U10.5(OUT(N))
NetU8_3: U8.3(AC(L)) U10.4(OUT(L))

Not connected (* = marked no-connect by the designer): U13 4(NC); U14 4(NC); U15 4(NC)

### Notes on the sheet
- (in symbol 电解电容) +

### Library data of the parts
C65 C69 C70 C73 C74 C76 C79 C80 C83 C84 C87 C115 C116 C118 = Capacitor
D6 D7 = I
L5 L6 = Ind
U11-U15 = L
D5 = SMBJ20A: Name: SMBJ20A
J1 = 三脚插头: Name: 三脚插头
LED7 = LED: Value: LED
Q9 = BC847: Name: BC847B
U8 = LH10-10B15: Name: LH10-10B15
U9 = FDC6326L: Name: FDC6326L
U10 = FC-LX1D: Name: FC-LX1D

## Sheet RJ45-2.SchDoc
size A4
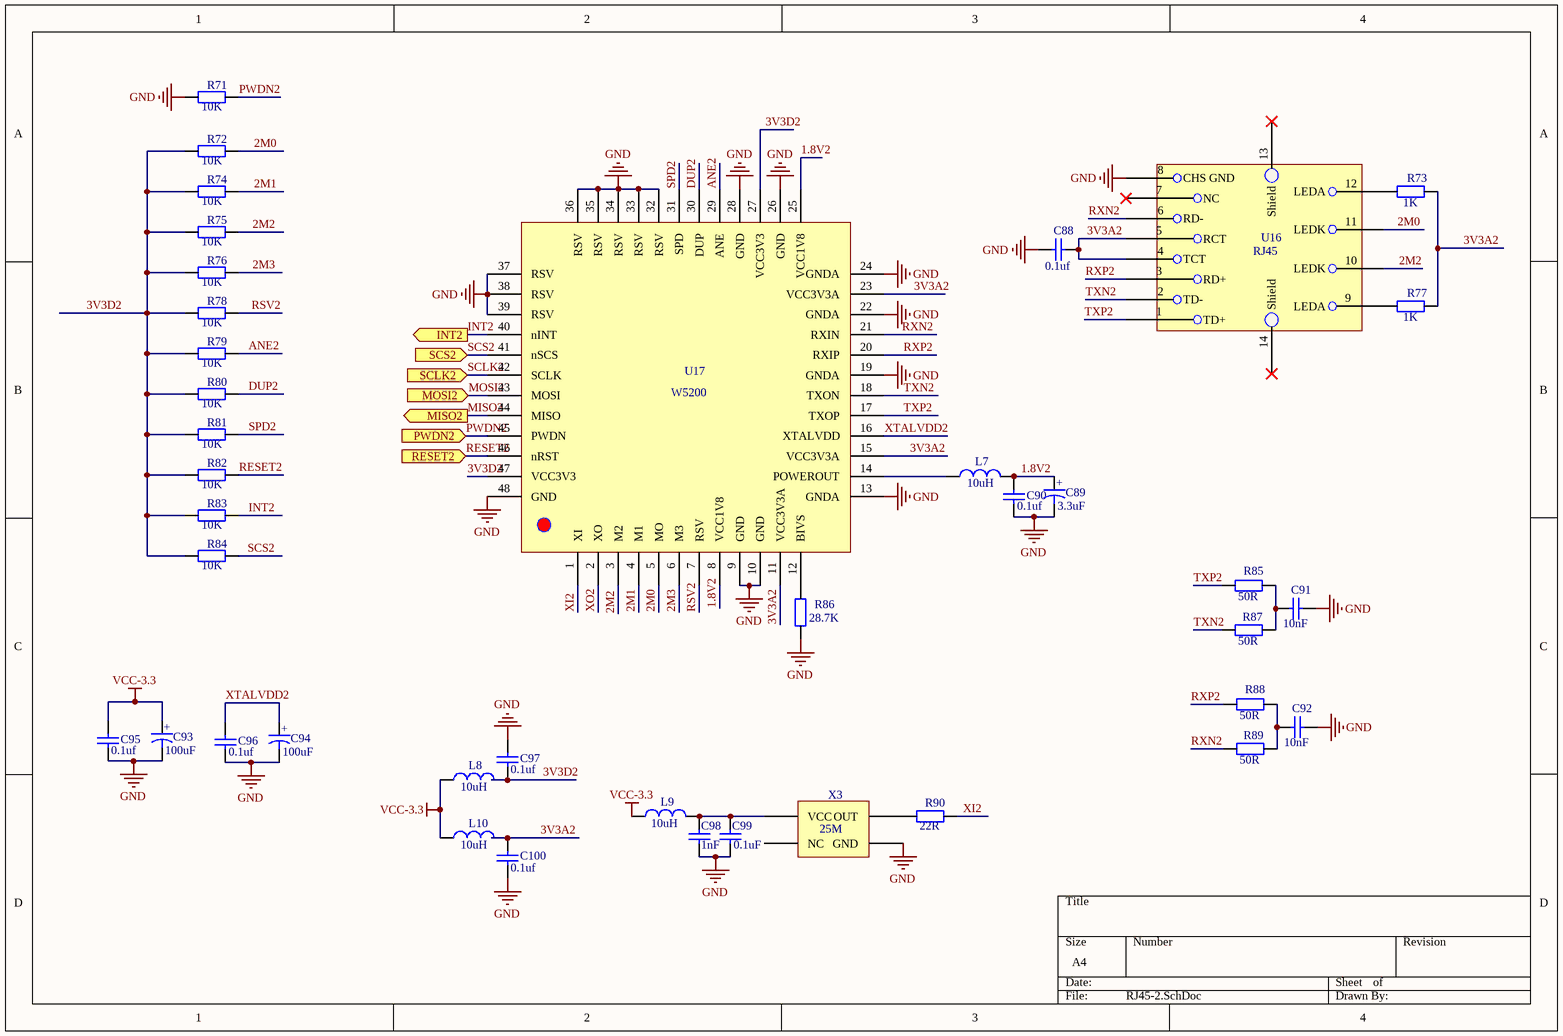
[diagram p5: RJ45-2.SchDoc]

### Parts
C88  value 0.1uf  [0603]  (hidden comment: Capacitor-0603)
C89  value 3.3uF  [钽电容1206（A3216）]  (hidden comment: 电解电容)
C90  value 0.1uf  [0603]  (hidden comment: Capacitor-0603)
C91  value 10nF  [0603]  (hidden comment: Capacitor-0603)
C92  value 10nF  [0603]  (hidden comment: Capacitor-0603)
C93  value 100uF  [钽电容1206（A3216）]  (hidden comment: 电解电容)
C94  value 100uF  [钽电容1206（A3216）]  (hidden comment: 电解电容)
C95  value 0.1uf  [0603]  (hidden comment: Capacitor-0603)
C96  value 0.1uf  [0603]  (hidden comment: Capacitor-0603)
C97  value 0.1uf  [0603]  (hidden comment: Capacitor-0603)
C98  value 1nF  [0603]  (hidden comment: Capacitor-0603)
C99  value 0.1uF  [0603]  (hidden comment: Capacitor-0603)
C100  value 0.1uf  [0603]  (hidden comment: Capacitor-0603)
L7  value 10uH  [0805]  (hidden comment: Inductor)
L8  value 10uH  [0805]  (hidden comment: Inductor)
L9  value 10uH  [0805]  (hidden comment: Inductor)
L10  value 10uH  [0805]  (hidden comment: Inductor)
R71  value 10K  [0603]  (hidden comment: Resistor-0603)
R72  value 10K  [0603]  (hidden comment: Resistor-0603)
R73  value 1K  [0603]  (hidden comment: Resistor-0603)
R74  value 10K  [0603]  (hidden comment: Resistor-0603)
R75  value 10K  [0603]  (hidden comment: Resistor-0603)
R76  value 10K  [0603]  (hidden comment: Resistor-0603)
R77  value 1K  [0603]  (hidden comment: Resistor-0603)
R78  value 10K  [0603]  (hidden comment: Resistor-0603)
R79  value 10K  [0603]  (hidden comment: Resistor-0603)
R80  value 10K  [0603]  (hidden comment: Resistor-0603)
R81  value 10K  [0603]  (hidden comment: Resistor-0603)
R82  value 10K  [0603]  (hidden comment: Resistor-0603)
R83  value 10K  [0603]  (hidden comment: Resistor-0603)
R84  value 10K  [0603]  (hidden comment: Resistor-0603)
R85  value 50R  [0603]  (hidden comment: Resistor-0603)
R86  value 28.7K  [0603]  (hidden comment: Resistor-0603)
R87  value 50R  [0603]  (hidden comment: Resistor-0603)
R88  value 50R  [0603]  (hidden comment: Resistor-0603)
R89  value 50R  [0603]  (hidden comment: Resistor-0603)
R90  value 22R  [0603]  (hidden comment: Resistor-0603)
U16  RJ45  [RJ45]
U17  Name: W5200  [W5200-Chip]  (hidden comment: W5200-Chip)
X3  value 25M  [有源晶振7050]  (hidden comment: 有源晶振)

### Ports
INT2 (out), MISO2 (out), MOSI2 (in), PWDN2 (in), RESET2 (in), SCLK2 (in), SCS2 (in)

### Nets
GND: C88.2 C89.1 C90.1 C91.2 C92.2 C93.1 C94.1 C95.1 C96.1 C97.2 C98.2 C99.2 C100.2 R71.1 R86.1 U16.8(CHS_GND) U17.9(GND) U17.10(GND) U17.13(GNDA) U17.19(GNDA) U17.22(GNDA) U17.24(GNDA) U17.26(GND) U17.28(GND) U17.32(RSV) U17.33(RSV) U17.34(RSV) U17.35(RSV) U17.36(RSV) U17.37(RSV) U17.38(RSV) U17.39(RSV) U17.48(GND) X3.2(GND)
VCC-3.3: C93.2 C95.2 L8.1 L9.1 L10.1
1.8V2: C89.2 C90.2 L7.2 U17.8(VCC1V8) U17.25(VCC1V8)
2M0: R72.2 U16.11(LEDK) U17.5(MO)
2M1: R74.2 U17.4(M1)
2M2: R75.2 U16.10(LEDK) U17.3(M2)
2M3: R76.2 U17.6(M3)
3V3A2: C88.1 C100.1 L10.2 R73.2 R77.2 U16.4(TCT) U16.5(RCT) U17.11(VCC3V3A) U17.15(VCC3V3A) U17.23(VCC3V3A)
3V3D2: C97.1 L8.2 R72.1 R74.1 R75.1 R76.1 R78.1 R79.1 R80.1 R81.1 R82.1 R83.1 R84.1 U17.27(VCC3V3) U17.47(VCC3V3)
ANE2: R79.2 U17.29(ANE)
DUP2: R80.2 U17.30(DUP)
INT2: R83.2 U17.40(nINT) ; port INT2
MISO2: U17.44(MISO) ; port MISO2
MOSI2: U17.43(MOSI) ; port MOSI2
PWDN2: R71.2 U17.45(PWDN) ; port PWDN2
RESET2: R82.2 U17.46(nRST) ; port RESET2
RSV2: R78.2 U17.7(RSV)
RXN2: R89.1 U16.6(RD-) U17.21(RXIN)
RXP2: R88.1 U16.3(RD+) U17.20(RXIP)
SCLK2: U17.42(SCLK) ; port SCLK2
SCS2: R84.2 U17.41(nSCS) ; port SCS2
SPD2: R81.2 U17.31(SPD)
TXN2: R87.1 U16.2(TD-) U17.18(TXON)
TXP2: R85.1 U16.1(TD+) U17.17(TXOP)
XI2: R90.2 U17.1(XI)
XO2: U17.2(XO)
XTALVDD2: C94.2 C96.2 U17.16(XTALVDD)
NetC91_1: C91.1 R85.2 R87.2
NetC92_1: C92.1 R88.2 R89.2
NetC98_1: C98.1 C99.1 L9.2 X3.4(VCC)
NetL7_1: L7.1 U17.14(POWEROUT)
NetR73_1: R73.1 U16.12(LEDA)
NetR77_1: R77.1 U16.9(LEDA)
NetR86_2: R86.2 U17.12(BIVS)
NetR90_1: R90.1 X3.3(OUT)

Not connected (* = marked no-connect by the designer): U16 7(NC)* 13(Shield)* 14(Shield)*; X3 1(NC)

### Notes on the sheet
- (in symbol 电解电容) +

### Library data of the parts
U16 = RJ45: Name: RJ45

## Sheet RJ45.SchDoc
size A4
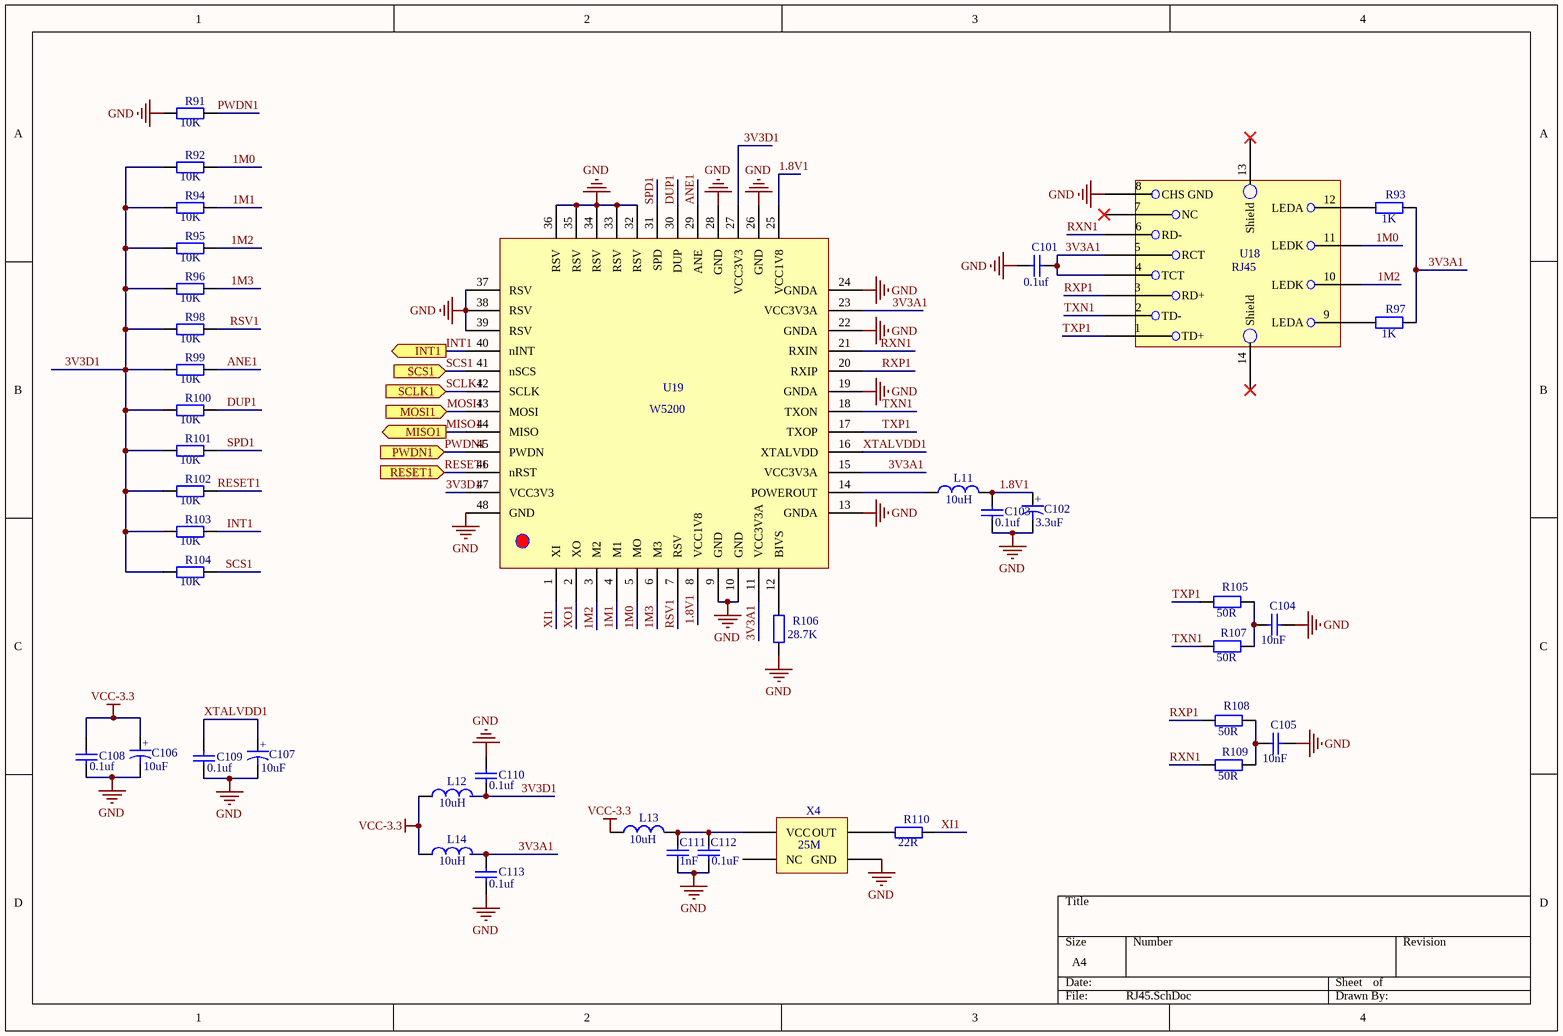
[diagram p6: RJ45.SchDoc]

### Parts
C101  value 0.1uf  [0603]  (hidden comment: Capacitor-0603)
C102  value 3.3uF  [钽电容1206（A3216）]  (hidden comment: 电解电容)
C103  value 0.1uf  [0603]  (hidden comment: Capacitor-0603)
C104  value 10nF  [0603]  (hidden comment: Capacitor-0603)
C105  value 10nF  [0603]  (hidden comment: Capacitor-0603)
C106  value 10uF  [钽电容1206（A3216）]  (hidden comment: 电解电容)
C107  value 10uF  [钽电容1206（A3216）]  (hidden comment: 电解电容)
C108  value 0.1uf  [0603]  (hidden comment: Capacitor-0603)
C109  value 0.1uf  [0603]  (hidden comment: Capacitor-0603)
C110  value 0.1uf  [0603]  (hidden comment: Capacitor-0603)
C111  value 1nF  [0603]  (hidden comment: Capacitor-0603)
C112  value 0.1uF  [0603]  (hidden comment: Capacitor-0603)
C113  value 0.1uf  [0603]  (hidden comment: Capacitor-0603)
L11  value 10uH  [0805]  (hidden comment: Inductor)
L12  value 10uH  [0805]  (hidden comment: Inductor)
L13  value 10uH  [0805]  (hidden comment: Inductor)
L14  value 10uH  [0805]  (hidden comment: Inductor)
R91  value 10K  [0603]  (hidden comment: Resistor-0603)
R92  value 10K  [0603]  (hidden comment: Resistor-0603)
R93  value 1K  [0603]  (hidden comment: Resistor-0603)
R94  value 10K  [0603]  (hidden comment: Resistor-0603)
R95  value 10K  [0603]  (hidden comment: Resistor-0603)
R96  value 10K  [0603]  (hidden comment: Resistor-0603)
R97  value 1K  [0603]  (hidden comment: Resistor-0603)
R98  value 10K  [0603]  (hidden comment: Resistor-0603)
R99  value 10K  [0603]  (hidden comment: Resistor-0603)
R100  value 10K  [0603]  (hidden comment: Resistor-0603)
R101  value 10K  [0603]  (hidden comment: Resistor-0603)
R102  value 10K  [0603]  (hidden comment: Resistor-0603)
R103  value 10K  [0603]  (hidden comment: Resistor-0603)
R104  value 10K  [0603]  (hidden comment: Resistor-0603)
R105  value 50R  [0603]  (hidden comment: Resistor-0603)
R106  value 28.7K  [0603]  (hidden comment: Resistor-0603)
R107  value 50R  [0603]  (hidden comment: Resistor-0603)
R108  value 50R  [0603]  (hidden comment: Resistor-0603)
R109  value 50R  [0603]  (hidden comment: Resistor-0603)
R110  value 22R  [0603]  (hidden comment: Resistor-0603)
U18  RJ45  [RJ45]
U19  Name: W5200  [W5200-Chip]  (hidden comment: W5200-Chip)
X4  value 25M  [有源晶振7050]  (hidden comment: 有源晶振)

### Ports
INT1 (out), MISO1 (out), MOSI1 (in), PWDN1 (in), RESET1 (in), SCLK1 (in), SCS1 (in)

### Nets
GND: C101.2 C102.1 C103.1 C104.2 C105.2 C106.1 C107.1 C108.1 C109.1 C110.2 C111.2 C112.2 C113.2 R91.1 R106.1 U18.8(CHS_GND) U19.9(GND) U19.10(GND) U19.13(GNDA) U19.19(GNDA) U19.22(GNDA) U19.24(GNDA) U19.26(GND) U19.28(GND) U19.32(RSV) U19.33(RSV) U19.34(RSV) U19.35(RSV) U19.36(RSV) U19.37(RSV) U19.38(RSV) U19.39(RSV) U19.48(GND) X4.2(GND)
VCC-3.3: C106.2 C108.2 L12.1 L13.1 L14.1
1.8V1: C102.2 C103.2 L11.2 U19.8(VCC1V8) U19.25(VCC1V8)
1M0: R92.2 U18.11(LEDK) U19.5(MO)
1M1: R94.2 U19.4(M1)
1M2: R95.2 U18.10(LEDK) U19.3(M2)
1M3: R96.2 U19.6(M3)
3V3A1: C101.1 C113.1 L14.2 R93.2 R97.2 U18.4(TCT) U18.5(RCT) U19.11(VCC3V3A) U19.15(VCC3V3A) U19.23(VCC3V3A)
3V3D1: C110.1 L12.2 R92.1 R94.1 R95.1 R96.1 R98.1 R99.1 R100.1 R101.1 R102.1 R103.1 R104.1 U19.27(VCC3V3) U19.47(VCC3V3)
ANE1: R99.2 U19.29(ANE)
DUP1: R100.2 U19.30(DUP)
INT1: R103.2 U19.40(nINT) ; port INT1
MISO1: U19.44(MISO) ; port MISO1
MOSI1: U19.43(MOSI) ; port MOSI1
PWDN1: R91.2 U19.45(PWDN) ; port PWDN1
RESET1: R102.2 U19.46(nRST) ; port RESET1
RSV1: R98.2 U19.7(RSV)
RXN1: R109.1 U18.6(RD-) U19.21(RXIN)
RXP1: R108.1 U18.3(RD+) U19.20(RXIP)
SCLK1: U19.42(SCLK) ; port SCLK1
SCS1: R104.2 U19.41(nSCS) ; port SCS1
SPD1: R101.2 U19.31(SPD)
TXN1: R107.1 U18.2(TD-) U19.18(TXON)
TXP1: R105.1 U18.1(TD+) U19.17(TXOP)
XI1: R110.2 U19.1(XI)
XO1: U19.2(XO)
XTALVDD1: C107.2 C109.2 U19.16(XTALVDD)
NetC104_1: C104.1 R105.2 R107.2
NetC105_1: C105.1 R108.2 R109.2
NetC111_1: C111.1 C112.1 L13.2 X4.4(VCC)
NetL11_1: L11.1 U19.14(POWEROUT)
NetR93_1: R93.1 U18.12(LEDA)
NetR97_1: R97.1 U18.9(LEDA)
NetR106_2: R106.2 U19.12(BIVS)
NetR110_1: R110.1 X4.3(OUT)

Not connected (* = marked no-connect by the designer): U18 7(NC)* 13(Shield)* 14(Shield)*; X4 1(NC)

### Notes on the sheet
- (in symbol 电解电容) +

### Library data of the parts
U18 = RJ45: Name: RJ45

## Nets that join several sheets
AFE_VCC: GC2200 (D1.2 D2.2 R13.2 U2.2,17,18,19), Power (6 pins)
GND: GC2200 (62 pins), MCU (43 pins), Module (23 pins), Power (52 pins), RJ45-2 (34 pins), RJ45 (34 pins)
VCC-3.3: Power (C82.2 C83.1 U14.1 U14.2), RJ45-2 (5 pins), RJ45 (5 pins)
VDD3.3: MCU (30 pins), Module (13 pins), Power (7 pins)
VDD-3.3: GC2200 (22 pins), Power (C86.2 C87.1 U15.1 U15.2)
INT: GC2200 (R2.1 U1.25), MCU (U3.34)
INT1: MCU (U3.67), RJ45 (R103.2 U19.40)
INT2: MCU (U3.45), RJ45-2 (R83.2 U17.40)
MISO1: MCU (U3.75), RJ45 (U19.44)
MISO2: MCU (U3.42), RJ45-2 (U17.44)
MOSI1: MCU (U3.76), RJ45 (U19.43)
MOSI2: MCU (U3.43), RJ45-2 (U17.43)
NetR41_1: MCU (U3.78), Module (R41.1)
NetR42_2: MCU (U3.81), Module (R42.2 U5.6)
NetR45_2: MCU (U3.82), Module (R45.2 U5.5)
NetR46_2: MCU (U3.80), Module (R46.2 U6.2 U6.3)
NetR49_1: MCU (U3.77), Module (R49.1)
NetR54_2: MCU (U3.139), Module (R54.2)
NetR55_2: MCU (U3.140), Module (R55.2)
NetR56_2: MCU (U3.141), Module (R56.2)
NetR57_2: MCU (U3.142), Module (R57.2)
NetR58_1: MCU (U3.101), Module (R58.1)
NetR59_1: MCU (U3.100), Module (R59.1)
NetR67_2: MCU (U3.103), Power (R67.2)
NetR69_2: MCU (U3.92), Power (R69.2)
PWDN1: MCU (U3.66), RJ45 (R91.2 U19.45)
PWDN2: MCU (U3.37), RJ45-2 (R71.2 U17.45)
RESET1: MCU (U3.65), RJ45 (R102.2 U19.46)
RESET2: MCU (U3.36), RJ45-2 (R82.2 U17.46)
RST1: GC2200 (R31.2 U1.24), MCU (U3.35)
SCLK1: MCU (U3.74), RJ45 (U19.42)
SCLK2: MCU (U3.41), RJ45-2 (U17.42)
SCS1: MCU (U3.73), RJ45 (R104.2 U19.41)
SCS2: MCU (U3.40), RJ45-2 (R84.2 U17.41)
SPI3_CLK: GC2200 (U1.35), MCU (U3.111)
SPI3_MISO: GC2200 (U1.33), MCU (U3.112)
SPI3_MOSI: GC2200 (U1.34), MCU (U3.113)
SPI3_NSS: GC2200 (U1.36), MCU (U3.114)